# EAGLE design freescale_dev_mc56f8006vlc (EAGLE 5.08)
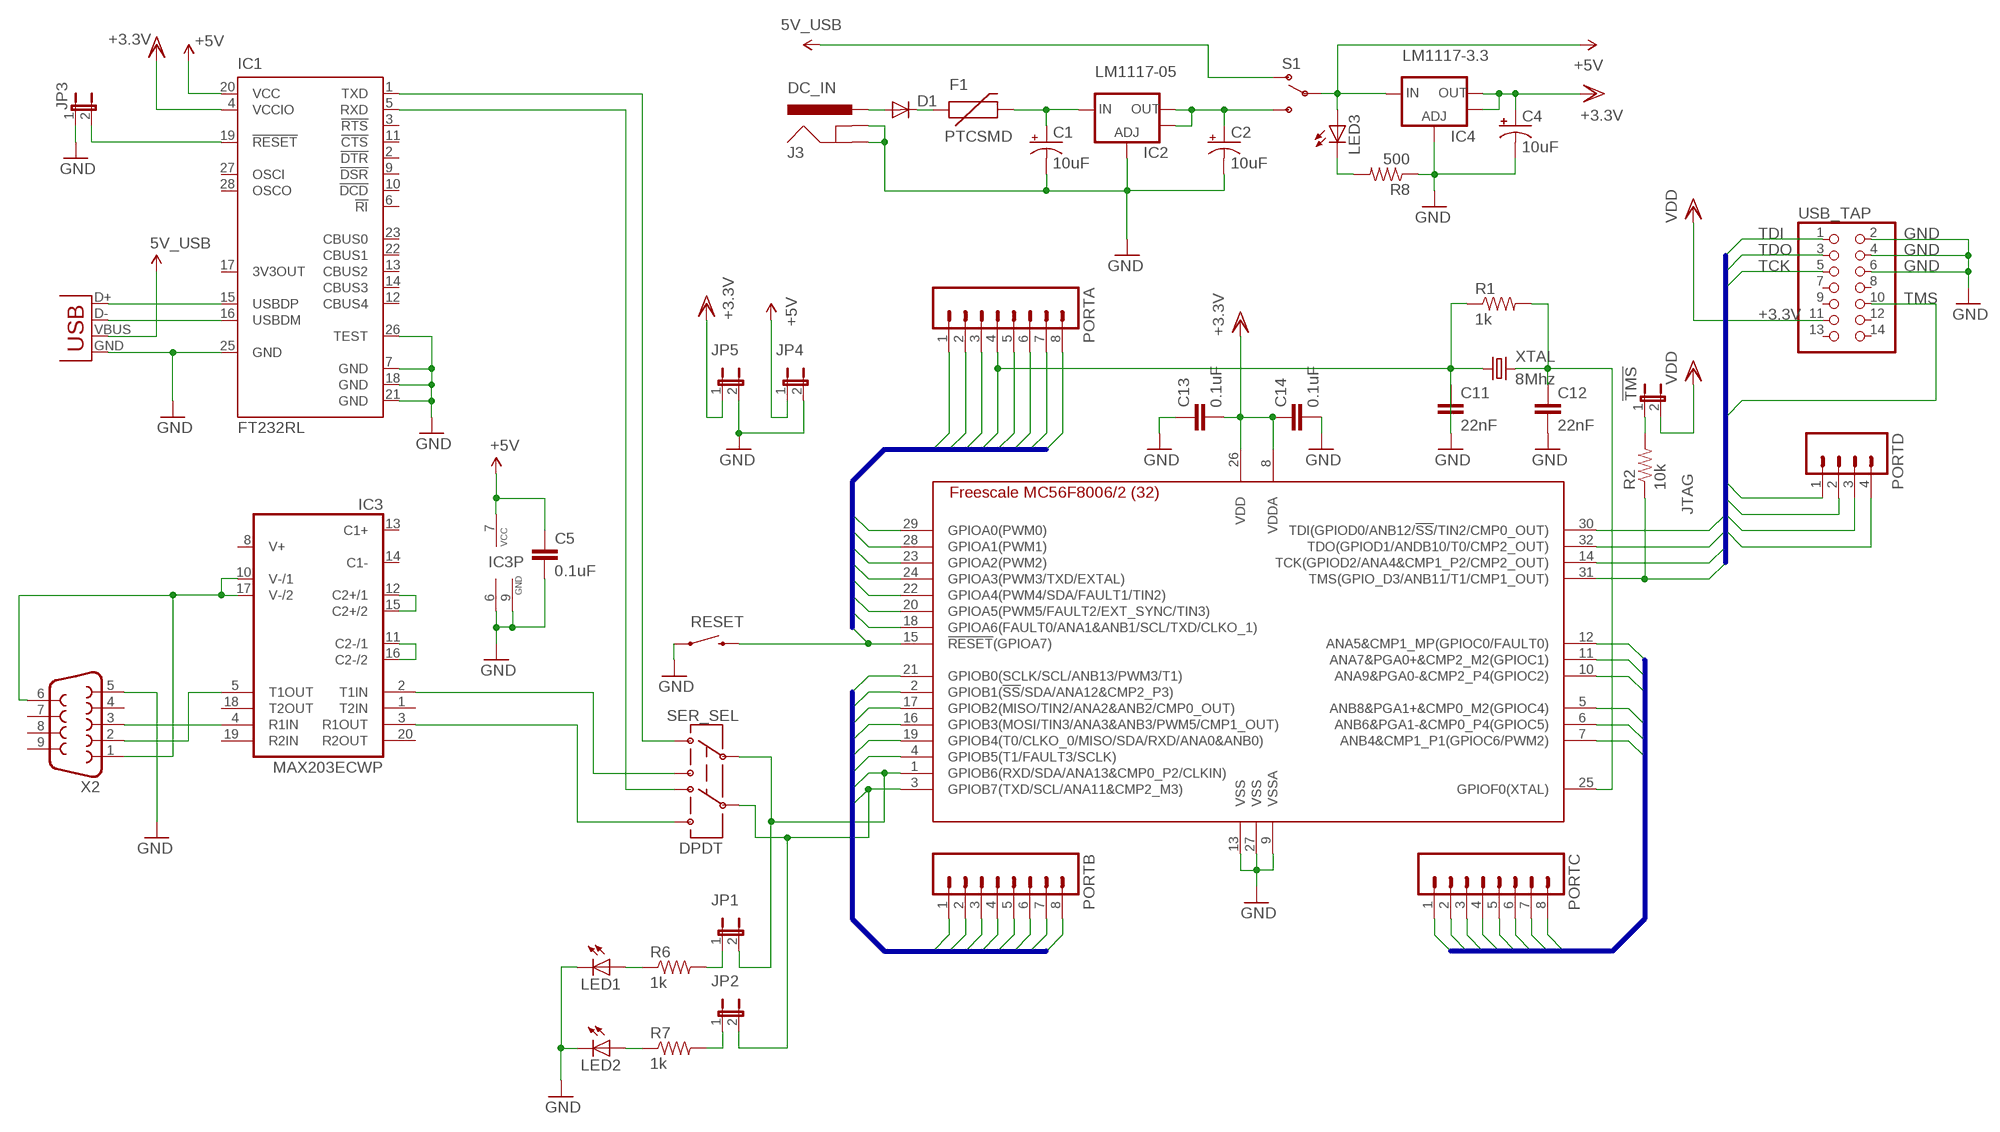
[diagram p0: schematic, sheet 1]

## Parts
!TMS  JUMPER-2PTH  [1X02]
C1  10uF  CAP_POLPTH2  [CPOL-RADIAL-10UF-25V]
C2  10uF  CAP_POLPTH2  [CPOL-RADIAL-10UF-25V]
C4  10uF  CAP_POLPTH2  [CPOL-RADIAL-10UF-25V]
C5  0.1uF  CAPPTH  [CAP-PTH-SMALL]
C11  22nF  CAPPTH  [CAP-PTH-SMALL]
C12  22nF  CAPPTH  [CAP-PTH-SMALL]
C13  0.1uF  CAPPTH  [CAP-PTH-SMALL]
C14  0.1uF  CAPPTH  [CAP-PTH-SMALL]
D1  DIODEHV  [DIODE-HV]
F1  PTCSMD  [PTC-1206]
IC1  FT232RL  [SSOP28]
IC2  LM1117-05  V_REG_LM1117SOT223  [SOT223]
IC3  MAX203ECWP  [SO20L]
IC4  LM1117-3.3  V_REG_LM1117SOT223  [SOT223]
J3  DC_IN  POWER_JACKPTH  [POWER_JACK_PTH]
JP1  JUMPER-2PTH  [1X02]
JP2  JUMPER-2PTH  [1X02]
JP3  JUMPER-2PTH  [1X02]
JP4  JUMPER-2PTH  [1X02]
JP5  JUMPER-2PTH  [1X02]
LED1  LED1206  [LED-1206]
LED2  LED1206  [LED-1206]
LED3  LED1206  [LED-1206]
PORTA  M08  [1X08]
PORTB  M08  [1X08]
PORTC  M08  [1X08]
PORTD  M04PTH  [1X04]
R1  1k  RESISTOR1206  [1206]
R2  10k  RESISTOR1206  [1206]
R6  1k  RESISTOR1206  [1206]
R7  1k  RESISTOR1206  [1206]
R8  500  RESISTOR1206  [1206]
RESET  SWITCH-MOMENTARY-2PTH  [TACTILE-PTH]
S1  SWITCH-SPSTSMD2  [SWITCH-SPDT-SMD]
SER_SEL  DPDT  SWITCH-DPDTPTH  [MSS22]
U1  MC56F8006  MC56F8006VLC  [TQFP32-08]
USB_TAP  PINHD-2X7  [2X07]
X1  USBPTH  [USB-B-PTH]
X2  DB9  [DB9]
XTAL  8Mhz  CRYSTALHC49US  [HC49US]

## Nets
5V_REG: C2.1(+) IC2.2(OUT) IC2.4(OUT) S1.3(S)
5V_USB: S1.1(O) X1.VBUS
+3.3V: !TMS.2 C4.1(+) C13.2 C14.1 IC1.4(VCCIO) IC4.2(OUT) IC4.4(OUT) JP5.1 U1.8(VDDA) U1.26(VDD) USB_TAP.11 ; supply symbol labelled VDD
+5V: C5.1 IC1.20(VCC) IC3.7(VCC) IC4.3(IN) JP4.1 LED3.A S1.2(P)
DC_IN: C1.1(+) F1.2 IC2.3(IN)
GND: C1.2(-) C2.2(-) C4.2(-) C5.2 C11.1 C12.2 C13.1 C14.2 IC1.7(GND) IC1.18(GND) IC1.21(GND) IC1.25(GND) IC1.26(TEST) IC2.1(ADJ) IC3.6(GND) IC3.9(GND) IC4.1(ADJ) J3.GND J3.GNDBREAK JP3.1 JP4.2 JP5.2 LED1.C LED2.C R8.1 RESET.1 U1.9(VSSA) U1.13(VSS) U1.27(VSS) USB_TAP.2 USB_TAP.4 USB_TAP.6 X1.GND X2.5(5(GND))
JP4: !TMS.1 R2.2
N$1: C12.1 R1.2 U1.25(GPIOF0(XTAL)) XTAL.2
N$2: IC1.5(RXD) SER_SEL.4
N$3: IC3.3(R1OUT) SER_SEL.6
N$4: IC1.15(USBDP) X1.D+
N$5: LED3.C R8.2
N$6: IC3.11(C2-/1) IC3.16(C2-/2)
N$7: IC1.19(!RESET) JP3.2
N$8: IC3.12(C2+/1) IC3.15(C2+/2)
N$9: D1.A J3.PWR
N$10: JP1.1 R6.2
N$12: D1.C F1.1
N$13: IC3.2(T1IN) SER_SEL.3
N$14: IC1.16(USBDM) X1.D-
N$17: JP2.1 R7.2
N$19: LED1.A R6.1
N$20: LED2.A R7.1
PORTA0: PORTA.1 U1.29(GPIOA0(PWM0))
PORTA1: PORTA.2 U1.28(GPIOA1(PWM1))
PORTA2: PORTA.3 U1.23(GPIOA2(PWM2))
PORTA3: C11.2 PORTA.4 R1.1 U1.24(GPIOA3(PWM3/TXD/EXTAL)) XTAL.1
PORTA4: PORTA.5 U1.22(GPIOA4(PWM4/SDA/FAULT1/TIN2))
PORTA5: PORTA.6 U1.20(GPIOA5(PWM5/FAULT2/EXT_SYNC/TIN3))
PORTA6: PORTA.7 U1.18(GPIOA6(FAULT0/ANA1&ANB1/SCL/TXD/CLKO_1))
PORTA7: PORTA.8 RESET.3 U1.15(!RESET!(GPIOA7))
PORTB0: PORTB.1 U1.21(GPIOB0(SCLK/SCL/ANB13/PWM3/T1))
PORTB1: PORTB.2 U1.2(GPIOB1(!SS!/SDA/ANA12&CMP2_P3))
PORTB2: PORTB.3 U1.17(GPIOB2(MISO/TIN2/ANA2&ANB2/CMP0_OUT))
PORTB3: PORTB.4 U1.16(GPIOB3(MOSI/TIN3/ANA3&ANB3/PWM5/CMP1_OUT))
PORTB4: PORTB.5 U1.19(GPIOB4(T0/CLKO_0/MISO/SDA/RXD/ANA0&ANB0))
PORTB5: PORTB.6 U1.4(GPIOB5(T1/FAULT3/SCLK))
PORTB6: JP1.2 PORTB.7 SER_SEL.2 U1.1(GPIOB6(RXD/SDA/ANA13&CMP0_P2/CLKIN))
PORTB7: JP2.2 PORTB.8 SER_SEL.5 U1.3(GPIOB7(TXD/SCL/ANA11&CMP2_M3))
PORTC0: PORTC.1 U1.12(ANA5&CMP1_MP(GPIOC0/FAULT0))
PORTC1: PORTC.2 U1.11(ANA7&PGA0+&CMP2_M2(GPIOC1))
PORTC2: PORTC.3 U1.10(ANA9&PGA0-&CMP2_P4(GPIOC2))
PORTC3: PORTC.4
PORTC4: PORTC.5 U1.5(ANB8&PGA1+&CMP0_M2(GPIOC4))
PORTC5: PORTC.6 U1.6(ANB6&PGA1-&CMP0_P4(GPIOC5))
PORTC6: PORTC.7 U1.7(ANB4&CMP1_P1(GPIOC6/PWM2))
PORTC7: PORTC.8
RS232_HANDSHAKE: IC3.10(V-/1) IC3.17(V-/2) X2.1(1(DCD)) X2.6(6(DSR))
RX: IC3.5(T1OUT) X2.2(2(RX))
SERIAL_SELECT: IC1.1(TXD) SER_SEL.1
TCK: PORTD.3 U1.14(TCK(GPIOD2/ANA4&CMP1_P2/CMP2_OUT)) USB_TAP.5
TDI: PORTD.1 U1.30(TDI(GPIOD0/ANB12/!SS!/TIN2/CMP0_OUT)) USB_TAP.1
TDO: PORTD.2 U1.32(TDO(GPIOD1/ANDB10/T0/CMP2_OUT)) USB_TAP.3
TMS: PORTD.4 R2.1 U1.31(TMS(GPIO_D3/ANB11/T1/CMP1_OUT)) USB_TAP.10
TX: IC3.4(R1IN) X2.3(3(TX))
Unconnected: IC1.2(!DTR) IC1.3(!RTS) IC1.6(!RI) IC1.9(!DSR) IC1.10(!DCD) IC1.11(!CTS) IC1.12(CBUS4) IC1.13(CBUS2) IC1.14(CBUS3) IC1.17(3V3OUT) IC1.22(CBUS1) IC1.23(CBUS0) IC1.27(OSCI) IC1.28(OSCO) IC3.1(T2IN) IC3.8(V+) IC3.13(C1+) IC3.14(C1-) IC3.18(T2OUT) IC3.19(R2IN) IC3.20(R2OUT) USB_TAP.7 USB_TAP.8 USB_TAP.9 USB_TAP.12 USB_TAP.13 USB_TAP.14 X2.4(4(DTR)) X2.7(7(RTS)) X2.8(8(CTS)) X2.9(9(RI))

## Buses
JTAG:TDI,TDO,TCK,TMS
PORTB[0..7]
PORTA[0..7]
PORTC[0..7]

## Notes on the sheet
- JTAG

## Library data of the parts
!TMS JP1-JP5 = SparkFun:JUMPER-2: Jumper Basic 0.1" spaced jumper. Use with breakaway headers.
C1 C2 C4 = SparkFun:CAP_POL: Capacitor Polarized These are standard SMD and PTH capacitors. Normally 10uF, 47uF, and 100uF in electrolytic and tantalum varieties. Always verify the external diameter of the through hole cap, it varies with capacity, voltage, and manufacturer. The EIA devices should be standard.
C5 C11-C14 = SparkFun:CAP: Capacitor Standard 0603 ceramic capacitor, and 0.1" leaded capacitor.
D1 = SparkFun:DIODE: Diode These are standard reverse protection diodes and small signal diodes. SMA package can handle up to about 1A. SOD-323 can handle about 200mA. What the SOD-323 package when ordering, there are some mfgs out there that are 5-pin packages.
F1 = SparkFun:PTC: Resettable Fuse PTC Resettable Fuse. Spark Fun Electronics SKU : COM-08357
IC1 = ftdichip:FT232R: Source: http://www.ftdichip.com/Documents/DataSheets/DS_FT232R_v104.pdf
IC2 IC4 = SparkFun:V_REG_LM1117: Voltage Regulator LM1117 Standard adjustable voltage regulator but in SMD form. Spark Fun Electronics SKU : COM-00595
IC3 = maxim:MAX203ECWP: RS232 TRANSEIVER
J3 = SparkFun:POWER_JACK: Power Jack This is the standard 5.5mm barrel jack for power. The PTH is the most common, proven, reliable, footprint. All others are experimental. The Slot footprint only works if the mill layer is transmitted to the PCB fab house so be warned. Spark Fun Electronics SKU : PRT-00119. Mating wall wart : TOL-00298 (and others)
LED1-LED3 = SparkFun:LED: LEDs Standard schematic elements and footprints for 5mm, 3mm, 1206, and 0603 sized LEDs. 5mm - Spark Fun Electronics SKU : COM-00529 (and others)
PORTA PORTB PORTC = SparkFun:M08: Header 8 Standard 8-pin 0.1" header. Use with straight break away headers (SKU : PRT-00116), right angle break away headers (PRT-00553), swiss pins (PRT-00743), machine pins (PRT-00117), and female headers (PRT-00115).
PORTD = SparkFun:M04: Header 4 Standard 4-pin 0.1" header. Use with straight break away headers (SKU : PRT-00116), right angle break away headers (PRT-00553), swiss pins (PRT-00743), machine pins (PRT-00117), and female headers (PRT-00115). Molex polarized connector foot print use with SKU : PRT-08231 with associated crimp pins and housings.
R1 R2 R6-R8 = SparkFun:RESISTOR: Resistor Basic schematic elements and footprints for 0603, 1206, and PTH 1/10th watt (small) resistors.
RESET = SparkFun:SWITCH-MOMENTARY-2
S1 = SparkFun:SWITCH-SPST: SPST Switch Simple slide switch. Spark Fun Electronics SKU : COM-00102
SER_SEL = SparkFun:SWITCH-DPDT: DPDT Version of the COM-00597, MSS22 is a 125VAC @ 300mA rated switch
U1 = freescale:MC56F8006VLC: MC56F800x: MC56F8006 and MCF56F8002 Digital Signal Controllers <https://www.freescale.com/webapp/sps/site/prod_summary.jsp?code=MC56F800x> The devices in the MC56F8006 series are members of Freescale's family of digital signal controllers (DSCs). The entry-level MC56F8006/2 DSC provides the most cost-optimized solution for mathematically-intensive, power-sensitive real-time control applications.
USB_TAP = pinhead:PINHD-2X7: PIN HEADER
X1 = SparkFun:USB: USB Connectors USB-B-PTH is fully proven SKU : PRT-00139 USB-miniB is fully proven SKU : PRT-00587 USB-A-PCB is untested. USB-A-H is throughly reviewed, but untested. Spark Fun Electronics SKU : PRT-00437 USB-B-SMT is throughly reviewed, but untested. Needs silkscreen touching up. USB-A-S has not been used/tested USB-MB-H has not been used/tested
X2 = SparkFun:DB9: DB9 Connector Standard DB9 (D-Sub 9) serial connector. Can be used for CAN bus as well as RS485 and RS232. Footprint production proven. Spark Fun Electronics SKU : PRT-00429
XTAL = SparkFun:CRYSTAL: Crystals Various standard crystals. Proven footprints. Spark Fun Electronics SKU : COM-00534

## Board
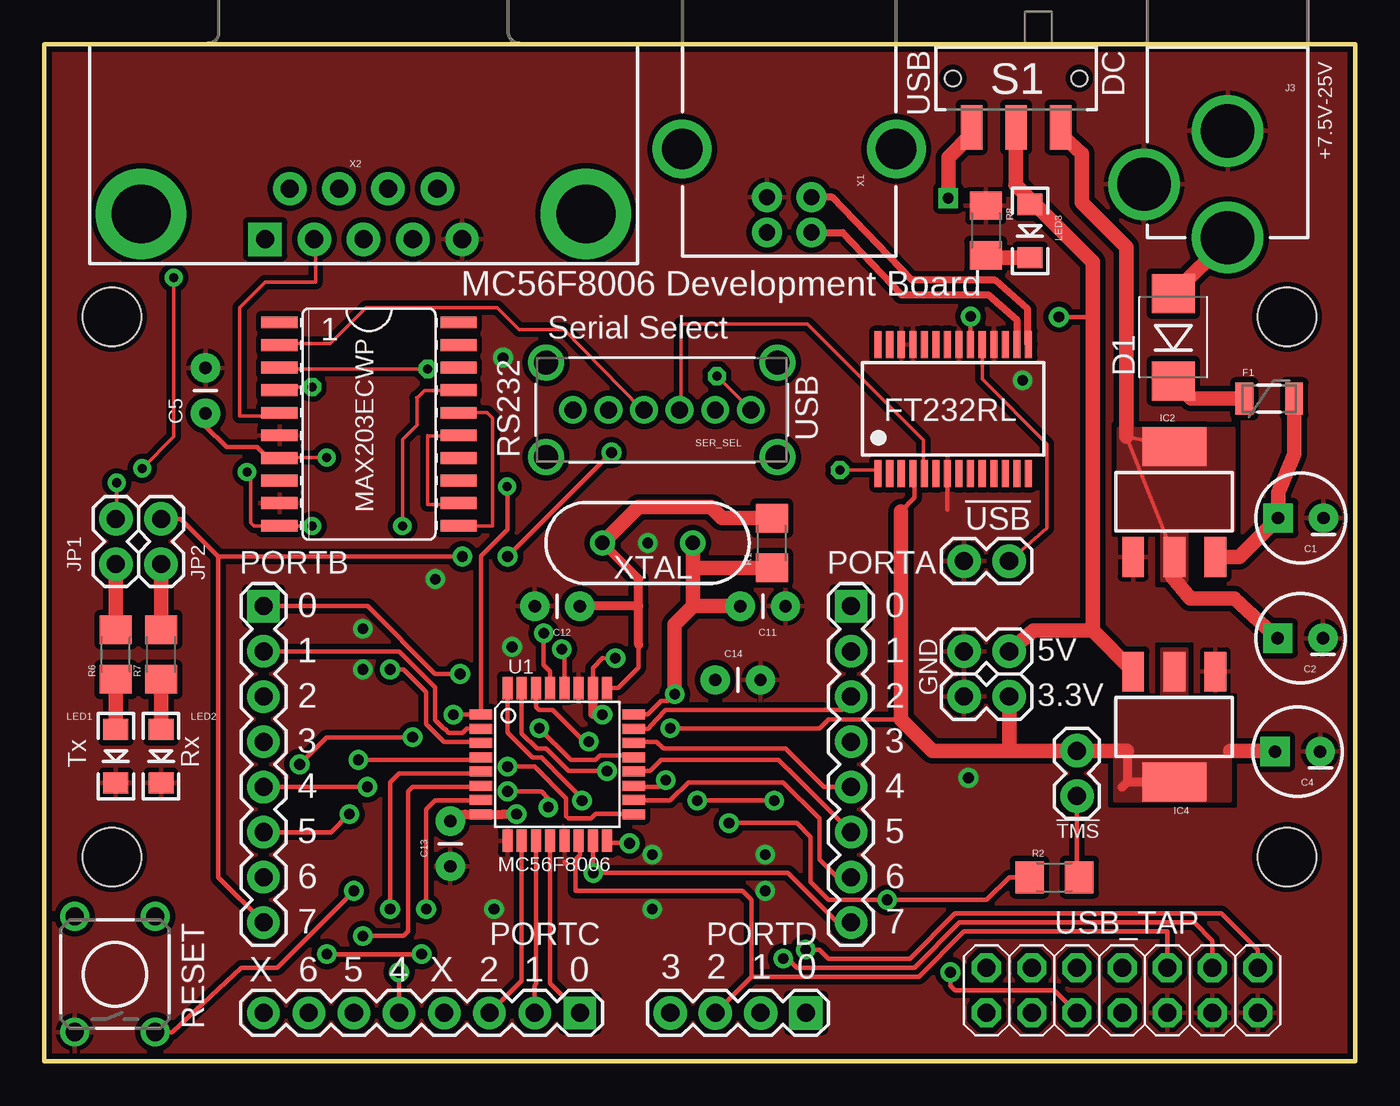
[diagram p1: board, top side]
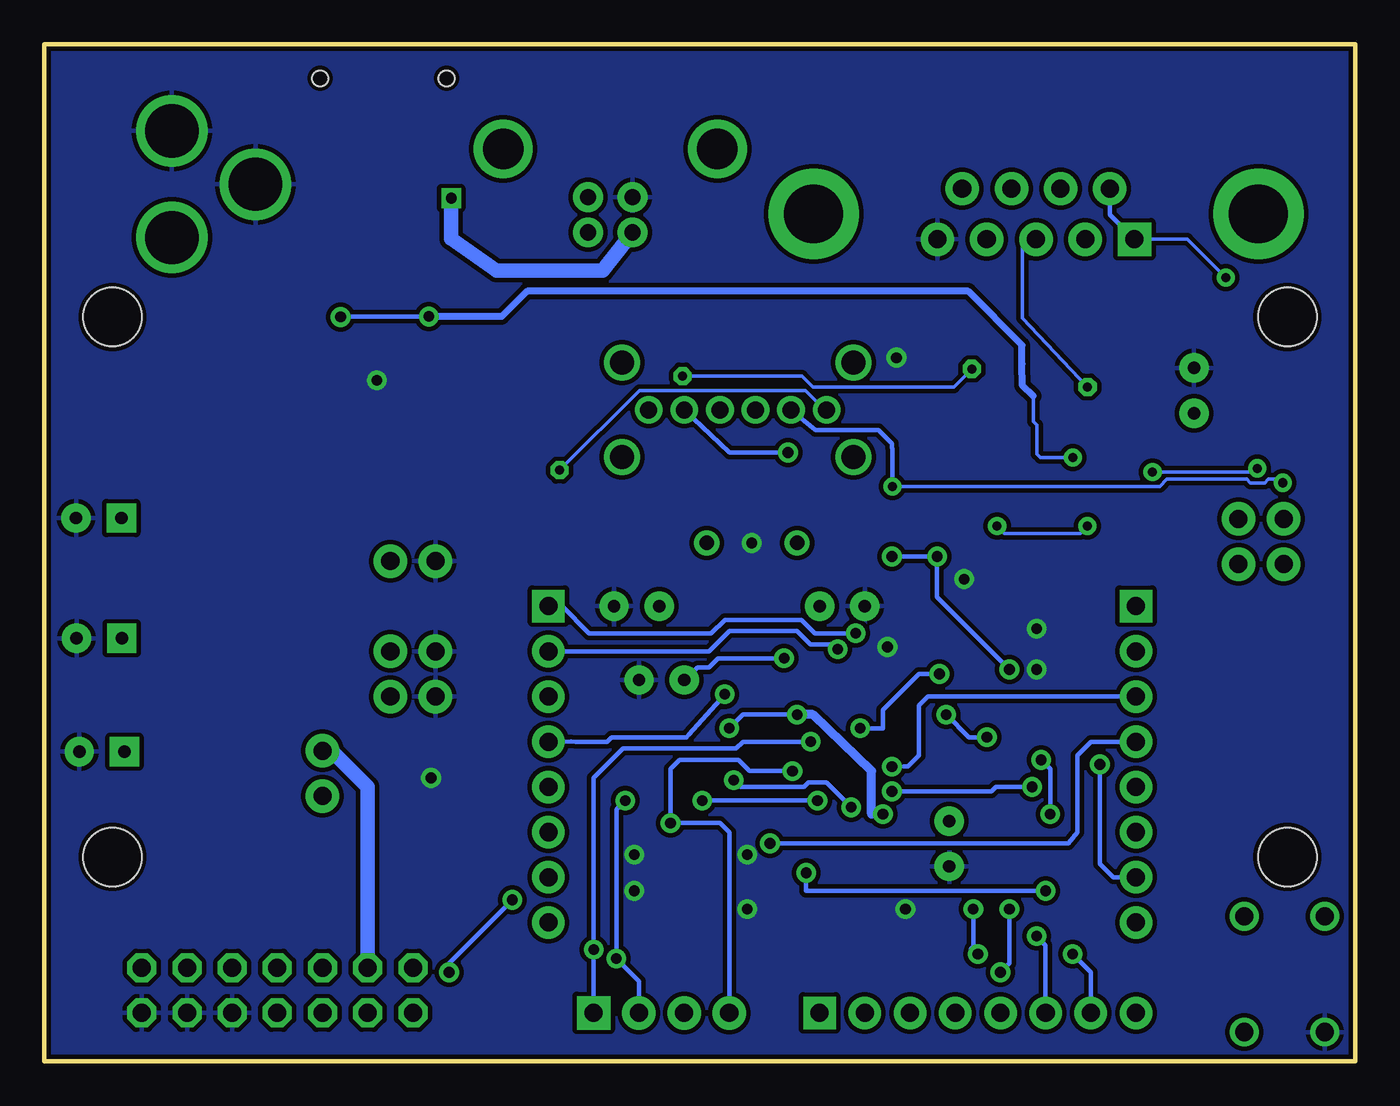
[diagram p2: board, bottom side, seen from below]

Size 73.66 x 57.15 mm. Coordinates in mm from the lower left corner, seen from the top.
Outline: 0,57.15 0,0 73.66,0 73.66,57.15 0,57.15
Copper layers (1*16): Top 0.035mm / dielectric 1.5mm / Bottom 0.035mm
Design rules "SparkFun *": minimum track width 8mil, minimum drill 20mil, track to track 8mil, track to pad 8mil, pad to pad 8mil, via to via 8mil, smd to smd 8mil, copper to edge 10mil, drill to drill 8mil, minimum pad ring 12mil, minimum via ring 10mil, stop-mask expansion 4mil, vias tented up to drill 25mil, thermal gap 10mil

### Footprints (pad centres in the part's own frame; a part is rotated, then mirrored left to right if it is on the bottom)
1X02 = drill 1.016 pad 1.88 round: 1 0,0; 2 2.54,0
CPOL-RADIAL-10UF-25V = drill 0.7 pad 1.651 square: 1 1.27,0 | drill 0.7 pad 1.651 round: 2 -1.27,0
CAP-PTH-SMALL = drill 0.7 pad 1.651 round: 1 0,0; 2 2.54,0
DIODE-HV = smd 2.2 x 2.4: A 2.454,0; C -2.454,0
PTC-1206 = smd 1 x 1.8: 1 -1.4,0; 2 1.4,0
SSOP28 = smd 0.4 x 1.5: 1 -4.225,-3.625; 2 -3.575,-3.625; 3 -2.925,-3.625; 4 -2.275,-3.625; 5 -1.625,-3.625; 6 -0.975,-3.625; 7 -0.325,-3.625; 8 0.325,-3.625; 9 0.975,-3.625; 10 1.625,-3.625; 11 2.275,-3.625; 12 2.925,-3.625; 13 3.575,-3.625; 14 4.225,-3.625; 15 4.225,3.625; 16 3.575,3.625; 17 2.925,3.625; 18 2.275,3.625; 19 1.625,3.625; 20 0.975,3.625; 21 0.325,3.625; 22 -0.325,3.625; 23 -0.975,3.625; 24 -1.625,3.625; 25 -2.275,3.625; 26 -2.925,3.625; 27 -3.575,3.625; 28 -4.225,3.625
SOT223 = smd 1.219 x 2.235: 1 -2.311,-3.099; 2 0,-3.099; 3 2.311,-3.099 | smd 3.6 x 2.2: 4 0,3.099
SO20L = smd 0.66 x 2.032: 1 -5.715,-5.029; 2 -4.445,-5.029; 3 -3.175,-5.029; 4 -1.905,-5.029; 5 -0.635,-5.029; 6 0.635,-5.029; 7 1.905,-5.029; 8 3.175,-5.029; 9 4.445,-5.029; 10 5.715,-5.029; 11 5.715,5.029; 12 4.445,5.029; 13 3.175,5.029; 14 1.905,5.029; 15 0.635,5.029; 16 -0.635,5.029; 17 -1.905,5.029; 18 -3.175,5.029; 19 -4.445,5.029; 20 -5.715,5.029
POWER_JACK_PTH = drill 2.997 round: GND 0,7.7; GNDBREAK 4.7,10.7; PWR 0,13.7
LED-1206 = smd 1.2 x 1.4: A -1.5,0; C 1.5,0
1X08 = drill 1.016 pad 1.829 square: 1 0,0 | drill 1.016 pad 1.829 round: 2 2.54,0; 3 5.08,0; 4 7.62,0; 5 10.16,0; 6 12.7,0; 7 15.24,0; 8 17.78,0
1X04 = drill 1.016 pad 1.88 square: 1 0,0 | drill 1.016 pad 1.88 round: 2 2.54,0; 3 5.08,0; 4 7.62,0
1206 = smd 1.6 x 1.8: 1 -1.4,0; 2 1.4,0
TACTILE-PTH = drill 1.016 round: 1 -3.251,2.261; 2 3.251,2.261; 3 -3.251,-2.261; 4 3.251,-2.261
SWITCH-SPDT-SMD = smd 1.2 x 2.5: 1 -2.5,-2.75; 2 0,-2.75; 3 2.5,-2.75 | hole 0.9: -3.55,0; 3.55,0
MSS22 = drill 0.95 round: 1 2.65,11.5; 2 2.65,9.5; 3 2.65,7.5; 4 2.65,5.5; 5 2.65,3.5; 6 2.65,1.5 | drill 1.35 round: NC 0,13; NC# 0,0; NC$ 5.3,0; NC@ 5.3,13
TQFP32-08 = smd 1.27 x 0.559: 1 -4.293,2.8; 2 -4.293,2; 3 -4.293,1.2; 4 -4.293,0.4; 5 -4.293,-0.4; 6 -4.293,-1.2; 7 -4.293,-2; 8 -4.293,-2.8; 17 4.293,-2.8; 18 4.293,-2; 19 4.293,-1.2; 20 4.293,-0.4; 21 4.293,0.4; 22 4.293,1.2; 23 4.293,2; 24 4.293,2.8 | smd 0.559 x 1.27: 9 -2.8,-4.293; 10 -2,-4.293; 11 -1.2,-4.293; 12 -0.4,-4.293; 13 0.4,-4.293; 14 1.2,-4.293; 15 2,-4.293; 16 2.8,-4.293; 25 2.8,4.293; 26 2,4.293; 27 1.2,4.293; 28 0.4,4.293; 29 -0.4,4.293; 30 -1.2,4.293; 31 -2,4.293; 32 -2.8,4.293
STAND-OFF = hole 3.302: 0,0
2X07 = drill 1.016 octagon: 1 -7.62,-1.27; 2 -7.62,1.27; 3 -5.08,-1.27; 4 -5.08,1.27; 5 -2.54,-1.27; 6 -2.54,1.27; 7 0,-1.27; 8 0,1.27; 9 2.54,-1.27; 10 2.54,1.27; 11 5.08,-1.27; 12 5.08,1.27; 13 7.62,-1.27; 14 7.62,1.27
USB-B-PTH = drill 0.914 pad 1.676 round: D+ 0,1.25; D- 1.981,1.25; GND 0,-1.25; VBUS 1.981,-1.25 | drill 2.286 round: P$1 -2.718,-6.02; P$2 -2.718,6.02
DB9 = drill 1.016 pad 1.88 square: 1 -5.54,-1.42 | drill 1.016 pad 1.88 round: 2 -2.77,-1.42; 3 0,-1.42; 4 2.77,-1.42; 5 5.54,-1.42; 6 -4.15,1.42; 7 -1.38,1.42; 8 1.38,1.42; 9 4.15,1.42 | drill 3.302 pad 5.08 round: G1 -12.5,0; G2 12.5,0
HC49US = drill 0.813 round: 1 -2.54,0; 2 2.54,0

### Placement (x,y rotation side)
!TMS  58.03,14.91 90 top
C1  70.61,30.53 180 top
C2  70.59,23.77 180 top
C4  70.43,17.4 180 top
C5  9.06,36.42 90 top
C11  41.65,25.57 180 top
C12  30.09,25.57 180 top
C13  22.8,10.95 90 top
C14  37.7,21.43 0 top
D1  63.45,40.69 90 top
F1  68.83,37.24 0 top
IC1  51.08,36.66 0 top
IC2  63.5,31.45 0 top
IC3  18.24,35.81 270 top
IC4  63.5,18.8 180 top
J3  66.5,59.99 180 top
JP1  4.01,27.94 90 top
JP2  6.55,27.94 90 top
JP3  51.68,28.11 0 top
JP4  54.22,23.03 180 top
JP5  54.22,20.49 180 top
LED1  4.01,17.15 270 top
LED2  6.55,17.15 270 top
LED3  55.4,46.67 270 top
PORTA  45.33,25.58 270 top
PORTB  12.31,25.58 270 top
PORTC  30.09,2.71 180 top
PORTD  42.79,2.71 180 top
R1  40.89,29.13 90 top
R2  56.76,10.33 0 top
R6  4.01,22.86 90 top
R7  6.55,22.86 90 top
R8  52.91,46.69 270 top
RESET  3.96,4.89 90 top
S1  54.61,55.25 0 top
SER_SEL  41.2,33.96 90 top
U1  28.82,16.68 0 top
U$1  [STAND-OFF]  69.84,11.48 0 top
U$2  [STAND-OFF]  69.84,41.83 0 top
U$3  [STAND-OFF]  3.8,41.83 0 top
U$4  [STAND-OFF]  3.8,11.48 0 top
USB_TAP  60.57,3.98 180 top
X1  41.86,48.56 270 top
X2  17.93,47.63 0 top
XTAL  33.9,29.13 180 top

### Tracks (layer width: path | path; a pad name or v marks a point on that pad's centre or on a via)
5V_REG
  Top 0.203: 63.4,27.23 IC2.2 60.81,35.1 IC2.4
  Top 0.406: S1.3 57.15,52.5 57.15,52.07 57.2,52.02
  Top 0.813: 57.2,52.02 58.32,51 58.32,48.26 60.81,45.77 60.81,35.1 | 63.4,27.23 64.41,26.01 66.88,26.01 C2.1
  pour Top (no thermals): 66.85,29.87 64.21,29.87 64.21,27.03 62.79,27.03 62.79,29.87 60.35,29.87 60.35,35.56 66.85,35.56
5V_USB  (via drill 0.6)
  Top 0.203: 52.11,52.11 S1.1 52.02,52.63
  Top 0.813: v50.8,48.51 50.8,50.8 52.11,52.11
  Bottom 0.813: X1.VBUS 42.29,44.45 48.26,44.45 50.8,46.23 v50.8,48.51
+3.3V  (via drill 0.6)
  Top 0.203: 69.1,17.45 C4.1
  Top 0.254: 25.77,13.88 25.77,13.89 | v35.17,18.72 43.55,18.72 44.06,19.22 48.12,19.22 | 48.12,30.91 48.89,31.67 48.89,32.95 IC1.4 | U1.26 30.82,22.11 31.36,22.65 v32.09,22.65
  Top 0.508: U1.26 30.82,19.51 v31.36,19.48 | 25.77,13.89 v26.53,13.89 | 25.77,13.88 U1.8 23.66,13.88 23.23,13.89 22.95,13.89 C13.2 | 60.85,15.7 60.57,15.41 | 60.85,15.7 IC4.4 | 60.82,17.45 60.85,17.42 60.85,15.7
  Top 0.813: 66.65,17.45 69.1,17.45 | 60.82,17.45 !TMS.2 54.22,17.45 | 48.12,30.91 48.12,19.22 49.9,17.45 54.22,17.45 | 54.22,17.45 JP5.1
  Bottom 0.254: v31.36,19.48 34.41,19.48 v35.17,18.72 | v32.09,22.65 35.81,22.65 36.31,22.15 36.95,22.15 37.2,21.89 C14.1
  Bottom 0.508: v31.36,19.48 30.47,19.48 27.17,16.3 27.17,13.89 v26.53,13.89
  Bottom 0.813: USB_TAP.11 55.49,15.41 57.52,17.45 !TMS.2
  pour Top (no thermals): 60.15,20.32 62.79,20.32 62.79,23.17 64.21,23.17 64.21,20.32 66.65,20.32 66.65,14.63 60.15,14.63
+5V  (via drill 0.51, 0.6)
  Top 0.203: v15.85,33.93 13.41,33.93 IC3.7 | S1.2 54.61,52.07 | 54.56,49.28 LED3.A
  Top 0.254: 12.56,33.91 IC3.7 | 12.56,33.91 12.32,33.91 | C5.1 9.01,35.73 10.23,34.51 11.96,34.51 12.56,33.91 | S1.2 54.37,52.26 | v52.05,41.86 IC1.20 | v57.01,41.83 58.93,41.83
  Top 0.406: 54.61,52.07 54.66,52.02
  Top 0.813: 58.93,24.21 IC4.3 | 58.93,24.21 58.93,41.83 58.93,44.91 54.56,49.28 54.61,49.33 S1.2 | JP4.1 55.59,24.21 58.93,24.21
  Bottom 0.203: v15.85,33.93 17.68,33.93 17.88,34.14 17.88,35.76 18.08,35.97 18.08,37.39
  Bottom 0.254: v52.05,41.86 56.48,41.86 v57.01,41.83
  Bottom 0.406: 18.08,37.39 18.69,37.97 18.71,39.19 18.71,40.25 21.74,43.28 46.53,43.28 47.95,41.86 v52.05,41.86
DC_IN
  Top 0.813: IC2.3 67.16,28.35 C1.1 | C1.1 69.49,30.53 | F1.2 70.23,34.14 70.26,34.14 69.34,31.95 C1.1
GND  (via drill 0.6)
  Top 0.254: 29.33,11.1 29.22,11.2 | IC1.7 50.75,31
  other vias: 54.98,38.27 34.15,8.56 26.28,23.29 34.15,11.6 40.5,9.57 40.5,11.6 33.9,29.13 51.93,15.92 21.96,27.1 25.77,39.54 17.9,22.02 17.9,24.3 25.26,8.56
  pour Bottom (isolate 0.254, rank 2): 73.66,57.15 0,57.15 0,0 73.66,0
  pour Top (isolate 0.305, rank 2): 0,57.15 73.27,57.32 73.27,0.17 50.41,0.41 46.25,0.14 37.25,0.06 10.58,0 0,0
JP4
  Top 0.254: !TMS.1 58.03,10.46 R2.2
N$1
  Top 0.254: U1.25 32.23,20.98 33.39,22.15 33.39,23.42
  Top 0.508: XTAL.2 33.39,27.1 33.39,25.57 | 33.39,23.42 33.39,25.57 | 33.39,25.57 C12.1
  Top 0.813: R1.2 38.09,30.53 37.46,31.16 33.39,31.16 XTAL.2
N$2
  Top 0.203: IC1.5 49.39,33.09 49.39,34.92 42.89,41.43 35.78,41.43 35.78,36.75 SER_SEL.4
N$3  (via drill 0.51)
  Top 0.203: v21.53,38.92 13.41,38.92 IC3.3 | v37.79,38.51 39.62,36.68 SER_SEL.6
  Bottom 0.203: v21.53,38.92 22.55,37.9 30.47,37.9 31.08,38.51 v37.79,38.51
N$4
  Top 0.203: IC1.15 55.26,40.34
  Top 0.406: X1.D+ 44.3,48.56 48.77,43.89 53.44,43.89 55.27,42.27 55.27,40.32 IC1.15
N$5
  Top 0.203: R8.2 53.03,45.17
  Top 0.813: 53.03,45.17 LED3.C
N$6
  Top 0.203: 23.97,36.27 23.36,36.27 IC3.16 24.89,36.45 25.2,36.14 25.2,30.07 23.37,30.07 IC3.11
N$7
  Top 0.203: IC1.19 52.7,39.69 52.7,38.33 56.34,34.7 56.34,29.96 JP3.2
N$8
  Top 0.203: 22.55,35.06 23.16,35.06 IC3.15 22.57,35.13 21.95,35.13 | 21.54,35.13 21.95,35.13 | 21.95,35.13 21.95,35.15 | 21.54,35.13 21.54,31.29 23.16,31.29 IC3.12 | 21.54,35.13 21.54,35.15
N$9
  Top 0.813: D1.A 66.5,46.19 J3.PWR
N$10
  Top 0.813: R6.2 JP1.1
N$12
  Top 0.813: D1.C 64.45,37.24 F1.1
N$13
  Top 0.203: IC3.2 13.41,40.34 16.05,40.34 18.08,42.37 25.43,42.37 26.68,41.12 29.2,41.12 33.52,36.68 SER_SEL.3
N$14
  Top 0.406: X1.D- 44.86,46.58 48.16,43.08 53.03,43.08 54.66,41.66 IC1.16
N$17
  Top 0.813: R7.2 JP2.1
N$19
  Top 0.813: LED1.A R6.1
N$20
  Top 0.813: LED2.A R7.1
PORTA0  (via drill 0.6)
  Top 0.254: U1.29 28.42,21.91 28.06,22.27 v28.06,24.05
  Bottom 0.254: v28.06,24.05 30.34,24.05 31.11,24.81 35.42,24.81 36.19,24.05 43.04,24.05 44.57,25.57 PORTA.1
PORTA1  (via drill 0.6)
  Top 0.254: U1.28 29.22,22.89 v29.07,23.16
  Bottom 0.254: v29.07,23.16 29.33,23.42 30.6,23.42 31.36,24.18 35.17,24.18 36.31,23.03 PORTA.2
PORTA2
  Top 0.254: U1.23 33.93,18.68 34.41,19.22 34.92,19.73 44.82,19.73 PORTA.3
PORTA3  (via drill 0.6)
  Top 0.254: U1.24 33.9,19.48 34.66,20.24 35.04,20.24 v35.42,20.62
  Top 0.813: 36.44,27.61 XTAL.1 | 36.44,25.57 35.42,24.56 v35.42,20.62 | 36.44,25.57 36.44,27.61 | 36.44,25.57 C11.2 | R1.1 36.56,27.73 36.44,27.61
  Bottom 0.254: PORTA.4 44.06,17.96 43.81,17.95 42.03,17.95 41.77,18.21 37.58,18.21 37.46,18.34 v35.42,20.62
PORTA4
  Top 0.254: PORTA.5 43.81,15.41 41.65,17.57 34.79,17.57 34.41,17.95 33.18,17.95 U1.22
PORTA5
  Top 0.254: PORTA.6 42.03,16.18 41.52,16.68 41.27,16.94 34.66,16.94 34.03,16.3 33.09,16.3 U1.20
PORTA6
  Top 0.254: PORTA.7 44.57,10.33 43.55,11.35 43.55,13.64 41.52,15.67 36.19,15.67 35.17,14.65 33.15,14.65 U1.18
PORTA7  (via drill 0.6)
  Top 0.254: PORTA.8 44.57,7.8 41.77,10.59 v30.85,10.59 30.82,11.64 U1.15 30.85,12.37 | v17.39,9.57 13.07,5.25 11.04,5.25 7.17,1.64 RESET.3
  Bottom 0.254: v17.39,9.57 30.85,9.57 v30.85,10.59
PORTB0  (via drill 0.6)
  Top 0.254: 33.26,16.94 U1.21 33.01,17.19 31.23,17.19 30.98,16.94 29.58,16.94 v27.8,18.72 | v23.36,21.76 21.96,21.76 18.15,25.57 PORTB.1
  Bottom 0.254: v27.8,18.72 26.53,18.72 26.53,19.73 24.5,21.76 v23.36,21.76
PORTB1
  Top 0.254: U1.2 23.74,18.72 23.49,18.46 22.72,18.46 22.5,18.68 22.47,18.68 21.96,19.19 21.96,21 19.93,23.03 PORTB.2
PORTB2  (via drill 0.6)
  Top 0.203: U1.17
  Top 0.254: U1.17 | U1.17 30.98,13.89 30.73,13.64 29.46,13.64 29.33,13.76 29.33,14.78 27.55,16.56 v26.03,16.56
  Bottom 0.203: 25.39,16.56 v26.03,16.56
  Bottom 0.254: 25.39,16.56 25.14,16.56 24.5,17.19 24.5,19.99 23.99,20.49 PORTB.3
PORTB3  (via drill 0.6)
  Top 0.254: U1.16 31.61,12.24 31.64,12.26 33.11,12.26 v32.88,12.24
  Bottom 0.254: PORTB.4 14.85,17.96 15.61,17.19 15.61,12.87 16.12,12.24 v32.88,12.24
PORTB4  (via drill 0.6)
  Top 0.254: U1.19 33.18,15.41 34.54,15.41 v34.92,15.8 | v26.03,15.16 27.93,15.16 28.31,14.78 v28.31,14.27 | v18.15,15.41 PORTB.5
  Bottom 0.254: v34.92,15.8 34.54,15.41 30.98,15.41 30.73,15.67 29.71,15.67 v28.31,14.27 | v26.03,15.16 20.44,15.16 20.18,15.41 v18.15,15.41
PORTB5  (via drill 0.6)
  Top 0.254: 24.5,17.11 U1.4 | 24.5,17.11 24.5,17.19 | 24.5,17.11 24.33,16.94 v17.64,16.94 | v17.14,13.89 16.12,12.87 PORTB.6
  Bottom 0.254: v17.64,16.94 17.14,16.43 v17.14,13.89
PORTB6  (via drill 0.51, 0.6)
  Top 0.203: v4.06,32.51 4.06,30.48 JP1.2
  Top 0.254: v26.01,32.31 26.03,32.29 26.03,29.89 24.53,28.39 U1.1 v22.98,19.48 | v14.34,16.68 15.87,18.21 v20.69,18.21
  Bottom 0.203: v4.06,32.51 4.27,32.72 4.88,32.72 5.08,32.51 5.89,32.51 6.1,32.72 10.57,32.72 10.97,32.31 v26.01,32.31
  Bottom 0.254: v26.01,32.31 26.01,34.45 26.03,34.46 26.03,34.72 26.79,35.48 30.32,35.48 SER_SEL.2 | v20.69,18.21 21.71,18.21 v22.98,19.48 | PORTB.7 13.58,10.33 14.34,11.1 v14.34,16.68
PORTB7  (via drill 0.6)
  Top 0.203: 24.34,17.95 U1.3
  Top 0.254: U1.3 24.46,17.95 | 24.34,17.95 22.47,17.95 21.45,18.97 21.45,20.75 20.18,22.02 v19.42,22.02 | PORTB.8 9.77,10.34 9.77,28.37 | 9.77,28.37 7.66,30.48 JP2.2 | 9.77,28.37 v23.49,28.37 | v26.03,28.37 v31.87,34.21
  Bottom 0.254: v19.42,22.02 23.49,26.08 v23.49,28.37 v26.03,28.37 | v31.87,34.21 35.17,34.21 35.68,34.72 SER_SEL.5
PORTC0
  Top 0.254: U1.12 28.42,4.38 PORTC.1
PORTC1
  Top 0.254: U1.11 27.62,4.31 27.55,4.24 PORTC.2 | PORTC.2
PORTC2
  Top 0.254: U1.10 26.82,4.52 PORTC.3
PORTC4  (via drill 0.6)
  Top 0.203: 24.42,16.18 U1.5
  Top 0.254: U1.5 24.38,16.43 | 24.42,16.18 19.93,16.18 19.42,15.67 v19.42,8.56 | PORTC.5 v19.93,5 | v19.93,5
  Bottom 0.254: v19.93,5 19.42,5.51 v19.42,8.56
PORTC5  (via drill 0.6)
  Top 0.203: 24.46,15.41 U1.6
  Top 0.254: 24.46,15.41 20.69,15.41 20.44,15.16 20.44,7.29 20.18,7.03 v17.9,7.03
  Bottom 0.254: v17.9,7.03 17.39,6.52 PORTC.6
PORTC6  (via drill 0.6)
  Top 0.254: 24.5,14.65 21.96,14.65 21.45,14.14 v21.45,8.56 | v15.87,6.02 v21.2,6.02
  Top 0.508: 24.5,14.65 U1.7
  Bottom 0.254: 21.45,6.27 v21.45,8.56 | v15.87,6.02 14.85,5 PORTC.7
  Bottom 0.508: v21.2,6.02 21.45,6.27
RS232_HANDSHAKE  (via drill 0.51)
  Top 0.203: IC3.17 23.16,37.7 21.38,37.7 20.95,37.27 | v15.04,30.07 13.41,30.07 IC3.10 13.21,30.07 11.79,30.07 11.58,30.28 11.58,32.92 v11.38,33.12 | v20.12,30.07 20.12,34.95 20.93,35.76 20.95,35.76 20.95,37.27 | 20.95,37.27 20.92,37.29 | v5.49,33.33 7.26,35.1 v7.26,44.04
  Bottom 0.203: v15.04,30.07 15.44,29.67 19.71,29.67 v20.12,30.07 | v5.49,33.33 5.69,33.12 v11.38,33.12 | v7.26,44.04 9.43,46.21 X2.1
  Bottom 0.254: X2.1 13.78,47.6 X2.6
RX
  Top 0.203: X2.2 15.13,45.82 15.23,45.42 15.23,43.79 12.39,43.79 10.97,42.37 10.97,36.27 13.2,36.27 IC3.5
SERIAL_SELECT  (via drill 0.51)
  Top 0.203: v44.7,33.23 46.73,33.23 IC1.1
  Bottom 0.203: v44.7,33.23 40.23,37.7 30.88,37.7 29.87,36.68 SER_SEL.1
TCK
  Top 0.254: USB_TAP.5 63.11,7.29 51.68,7.29 49.14,4.75 39.74,4.75 | 39.74,4.75 PORTD.3 | U1.14 30.09,12.32 30.09,11.6 29.84,11.35 29.84,9.57 39.23,9.57 39.74,9.06 39.74,4.75
TDI  (via drill 0.6)
  Top 0.254: U1.30 27.62,19.92 27.8,19.73 28.57,19.73 30.34,17.95 v30.6,17.95 | USB_TAP.1 68.19,6.27 66.16,8.3 51.17,8.3 48.63,5.76 44.06,5.76 43.55,6.27 v42.79,6.27 | PORTD.1
  Bottom 0.254: PORTD.1 v42.79,6.27 42.79,15.92 41.14,17.57 34.79,17.57 34.41,17.95 v30.6,17.95
TDO  (via drill 0.6)
  Top 0.254: U1.32 26.02,18.47 27.42,17.07 27.93,17.07 29.2,15.8 30.22,14.78 v30.22,14.65 | v41.01,14.65 v36.69,14.65 | USB_TAP.3 65.65,6.78 64.63,7.79 51.43,7.79 48.89,5.25 42.28,5.25 41.77,5.76 v41.52,5.76
  Bottom 0.254: v41.01,14.65 41.52,14.14 41.52,12.37 v41.52,5.76 40.25,4.49 PORTD.2 | v36.69,14.65 v30.22,14.65
TMS  (via drill 0.6)
  Top 0.254: U1.31 26.82,18.43 27.68,17.57 28.19,17.57 29.46,16.3 v31.61,16.3 | v38.47,13.38 42.28,13.38 43.04,12.62 43.04,10.08 44.06,9.06 v47.36,9.06 52.95,9.06 54.22,10.33 R2.1 | v50.92,5 50.92,4.24 51.17,3.98 56.76,3.98 USB_TAP.10
  Bottom 0.254: v31.61,16.3 34.03,16.3 34.66,16.94 37.96,16.94 38.47,16.43 v38.47,13.38 35.68,13.38 35.17,12.87 PORTD.4 | v47.36,9.06 50.92,5.51 v50.92,5 | PORTD.4
TX  (via drill 0.51)
  Top 0.203: v15.03,37.9 13.41,37.9 IC3.4
  Bottom 0.203: v15.03,37.9 18.69,41.76 18.69,45.82 X2.3

### Text on the board
tPlace: USB | DC | +7.5V-25V | MC56F8006 Development Board | 1 | Serial Select | USB | RS232 | !USB | 0 | 0 | 1 | 1 | 5V | 2 | 2 | GND | 3.3V | 3 | 3 | Tx | Rx | 4 | 4 | 5 | 5 | 6 | 6 | 7 | 7 | X | 6 | 5 | 4 | X | 2 | 1 | 0 | 3 | 2 | 1 | 0